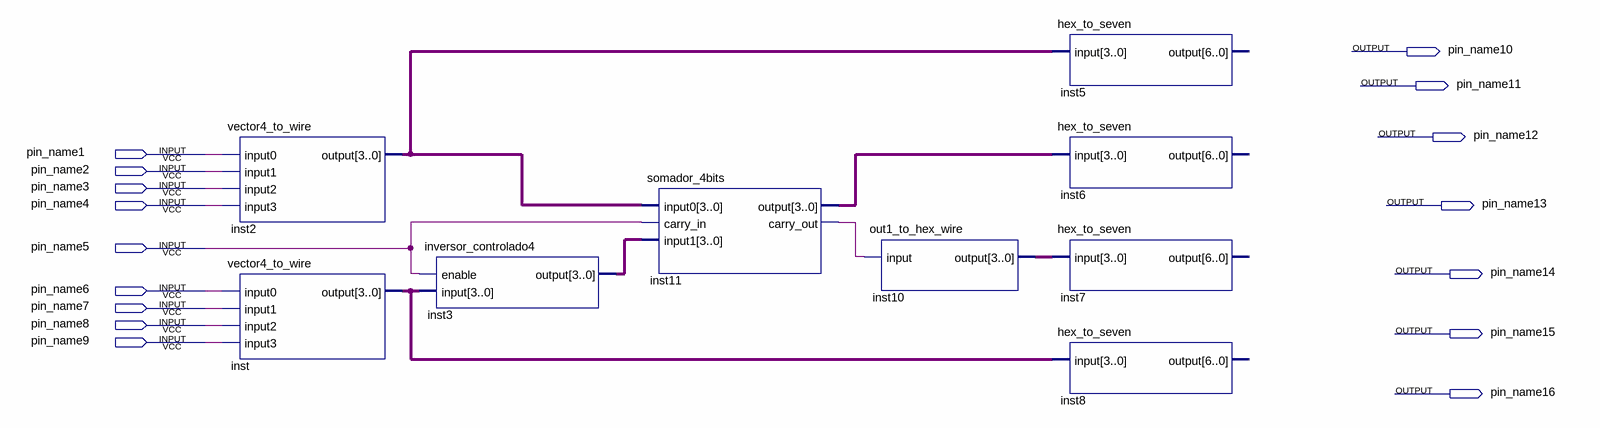
[diagram p0: schematic sheet]
// Quartus schematic lab01.bdf as structural Verilog: 9 symbols, 16 pins
module lab01 (
  input  pin_name1,
  input  pin_name2,
  input  pin_name3,
  input  pin_name4,
  input  pin_name5,
  input  pin_name6,
  input  pin_name7,
  input  pin_name8,
  input  pin_name9,
  output pin_name10,
  output pin_name11,
  output pin_name12,
  output pin_name13,
  output pin_name14,
  output pin_name15,
  output pin_name16
);

  wire inst11_carry_out;
  wire [3:0] inst2_output, inst3_output, inst10_output, inst11_output, inst_output;

  vector4_to_wire inst2 (
    .input0(pin_name1), .input1(pin_name2), .input2(pin_name3), .input3(pin_name4), .\output (inst2_output));
  vector4_to_wire inst (
    .input0(pin_name6), .input1(pin_name7), .input2(pin_name8), .input3(pin_name9), .\output (inst_output));
  inversor_controlado4 inst3 (.enable(pin_name5), .\input (inst_output), .\output (inst3_output));
  somador_4bits inst11 (
    .input0(inst2_output), .carry_in(pin_name5), .input1(inst3_output), .\output (inst11_output),
    .carry_out(inst11_carry_out));
  out1_to_hex_wire inst10 (.\input (inst11_carry_out), .\output (inst10_output));
  hex_to_seven inst5 (.\input (inst2_output));  // open: output
  hex_to_seven inst6 (.\input (inst11_output));  // open: output
  hex_to_seven inst7 (.\input (inst10_output));  // open: output
  hex_to_seven inst8 (.\input (inst_output));  // open: output
endmodule
